# EAGLE design EXTRUDER (EAGLE 6.5.0)
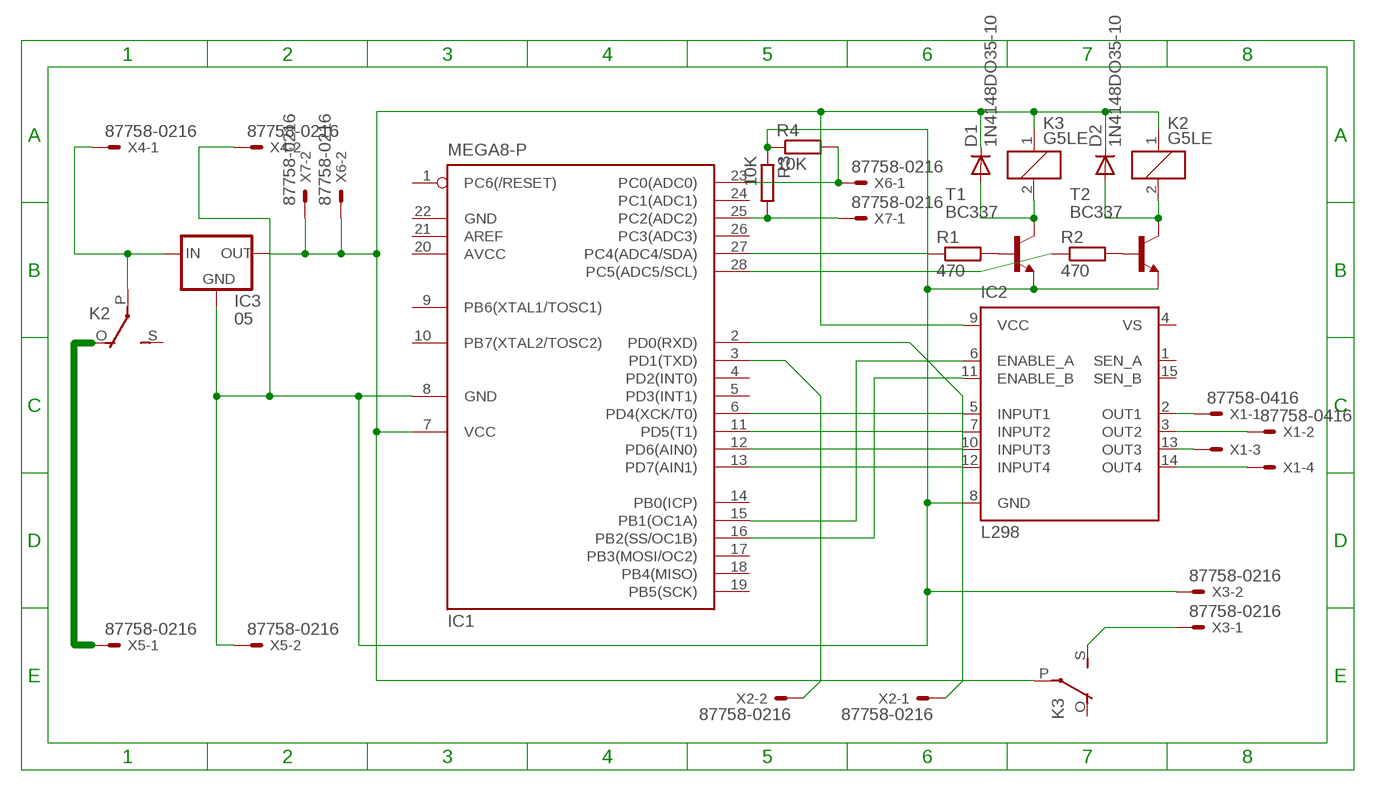
[diagram p0: schematic, sheet 1]

## Parts
D1  1N4148DO35-10  [DO35-10]
D2  1N4148DO35-10  [DO35-10]
IC1  MEGA8-P  [DIL28-3]
IC2  L298  [MULTIWATT-15]
IC3  05  78XXL  [78XXL]
K2  G5LE  [G5LE]
K3  G5LE  [G5LE]
R1  470  R-EU_0204/5  [0204/5]
R2  470  R-EU_0204/5  [0204/5]
R3  10K  R-EU_0204/5  [0204/5]
R4  10K  R-EU_0204/5  [0204/5]
T1  BC337  [TO92]
T2  BC337  [TO92]
X1  87758-0416  [87758-0416]
X2  87758-0216  [87758-0216]
X3  87758-0216  [87758-0216]
X4  87758-0216  [87758-0216]
X5  87758-0216  [87758-0216]
X6  87758-0216  [87758-0216]
X7  87758-0216  [87758-0216]

## Nets
N$1: IC1.6(PD4(XCK/T0)) IC2.5(INPUT1)
N$2: IC1.11(PD5(T1)) IC2.7(INPUT2)
N$3: IC1.12(PD6(AIN0)) IC2.10(INPUT3)
N$4: IC1.13(PD7(AIN1)) IC2.12(INPUT4)
N$5: IC1.15(PB1(OC1A)) IC2.6(ENABLE_A)
N$6: IC1.16(PB2(SS/OC1B)) IC2.11(ENABLE_B)
N$7: D1.A K3.2 T1.3(C)
N$9: IC1.23(PC0(ADC0)) R4.2 X6.1
N$10: D2.A K2.2 T2.3(C)
N$11: D1.C D2.C IC1.7(VCC) IC2.9(VCC) IC3.OUT K2.1 K3.1 K3.P(2:P) X6.2 X7.2
N$13: R1.2 T1.2(B)
N$14: R2.2 T2.2(B)
N$15: IC1.27(PC4(ADC4/SDA)) R1.1
N$16: IC1.28(PC5(ADC5/SCL)) R2.1
N$17: IC1.3(PD1(TXD)) X2.2
N$18: IC1.2(PD0(RXD)) X2.1
N$19: IC2.2(OUT1) X1.1
N$20: IC2.3(OUT2) X1.2
N$21: IC2.13(OUT3) X1.3
N$22: IC2.14(OUT4) X1.4
N$23: K3.S(2:S) X3.1
N$24: IC3.IN K2.P(2:P) X4.1
N$25: IC1.25(PC2(ADC2)) R3.2 X7.1
N$26: K2.O(2:O) X5.1
N$27: IC1.8(GND) IC2.8(GND) IC3.GND R3.1 R4.1 T1.1(E) T2.1(E) X3.2 X4.2 X5.2
Unconnected: IC1.1(PC6(/RESET)) IC1.4(PD2(INT0)) IC1.5(PD3(INT1)) IC1.9(PB6(XTAL1/TOSC1)) IC1.10(PB7(XTAL2/TOSC2)) IC1.14(PB0(ICP)) IC1.17(PB3(MOSI/OC2)) IC1.18(PB4(MISO)) IC1.19(PB5(SCK)) IC1.21(AREF) IC1.24(PC1(ADC1)) IC1.26(PC3(ADC3)) IC2.1(SEN_A) IC2.15(SEN_B) K2.S(2:S) K3.O(2:O)

## Power pins joined to a net without a drawn wire
AVCC: IC1.20(AVCC)
GND: IC1.22(GND)
VS: IC2.4(VS)

## Library data of the parts
D1 D2 = diode:1N4148: DIODE high speed (Philips)
IC1 = atmel:MEGA8-P: MICROCONTROLLER 8 Kbytes FLASH, 1 kbytes SRAM, 512 bytes EEPROM, USART, 4-channel 10 bit ADC, 2-channel 8 bit ADC Pin compatible with Atmega48, ATMega88, ATMega168 Source: avr.lbr; OC_FARNELL: unknown; OC_NEWARK: unknown
IC2 = st-microelectronics:L298: DUAL FULL-BRIDGE DRIVER; MPN: L298N; OC_FARNELL: 1589425; OC_NEWARK: 32M1527
IC3 = v-reg:78XXL: VOLTAGE REGULATOR
K2 K3 = relay:G5LE: RELAY 1 x switch, 10 A/120 V AC, 8 A/30 V DC, Omron; OC_FARNELL: unknown; OC_NEWARK: unknown
R1-R4 = rcl:R-EU_: RESISTOR, European symbol
T1 T2 = transistor:BC337: NPN TRANSISTOR
X1 = con-molex:87758-0416: 4 Pin - 2mm Dual Row Single Wafer, Vertical T/H HDR Source: http://www.molex.com/pdm_docs/sd/877580616_sd.pdf; MF: FARNELL; MPN: 87758-0416; OC_FARNELL: 7472315; OC_NEWARK: 39K3681
X2-X7 = con-molex:87758-0216: 2 Pin - 2mm Dual Row Single Wafer, Vertical T/H HDR Source: http://www.molex.com/pdm_docs/sd/877580616_sd.pdf; MPN: 87758-0216; OC_FARNELL: unknown; OC_NEWARK: 94M1513

## Board
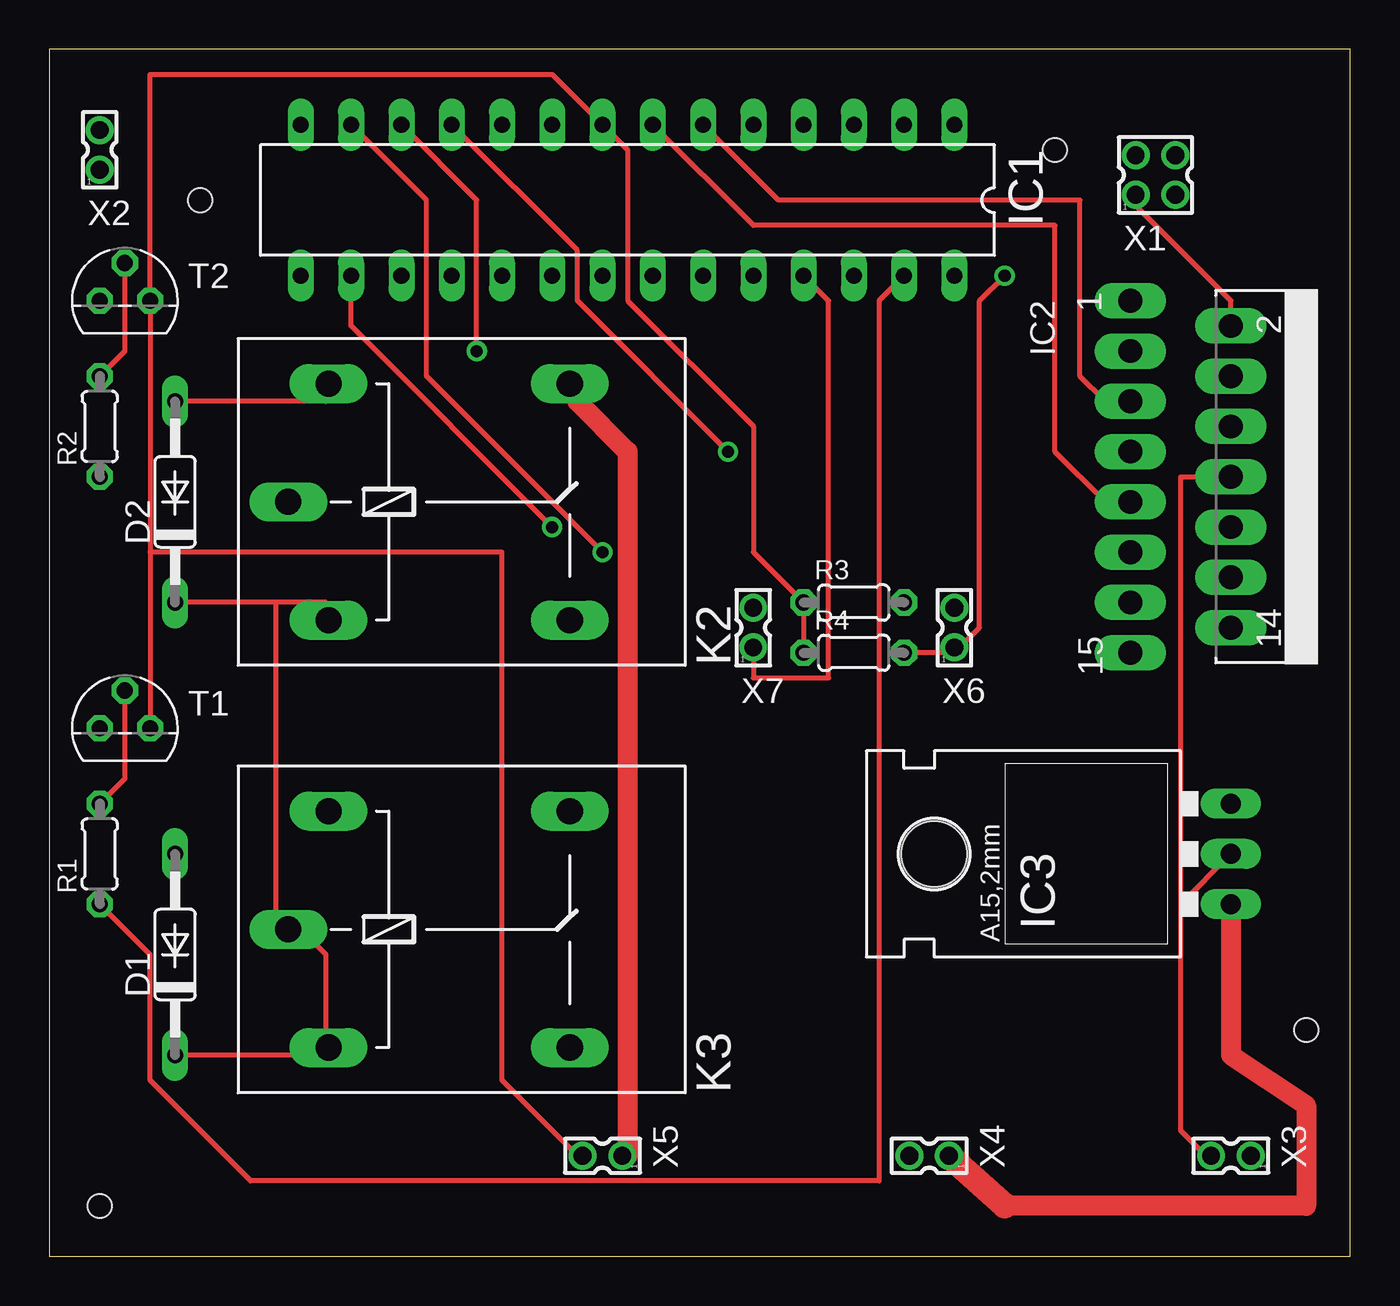
[diagram p1: board, top side]
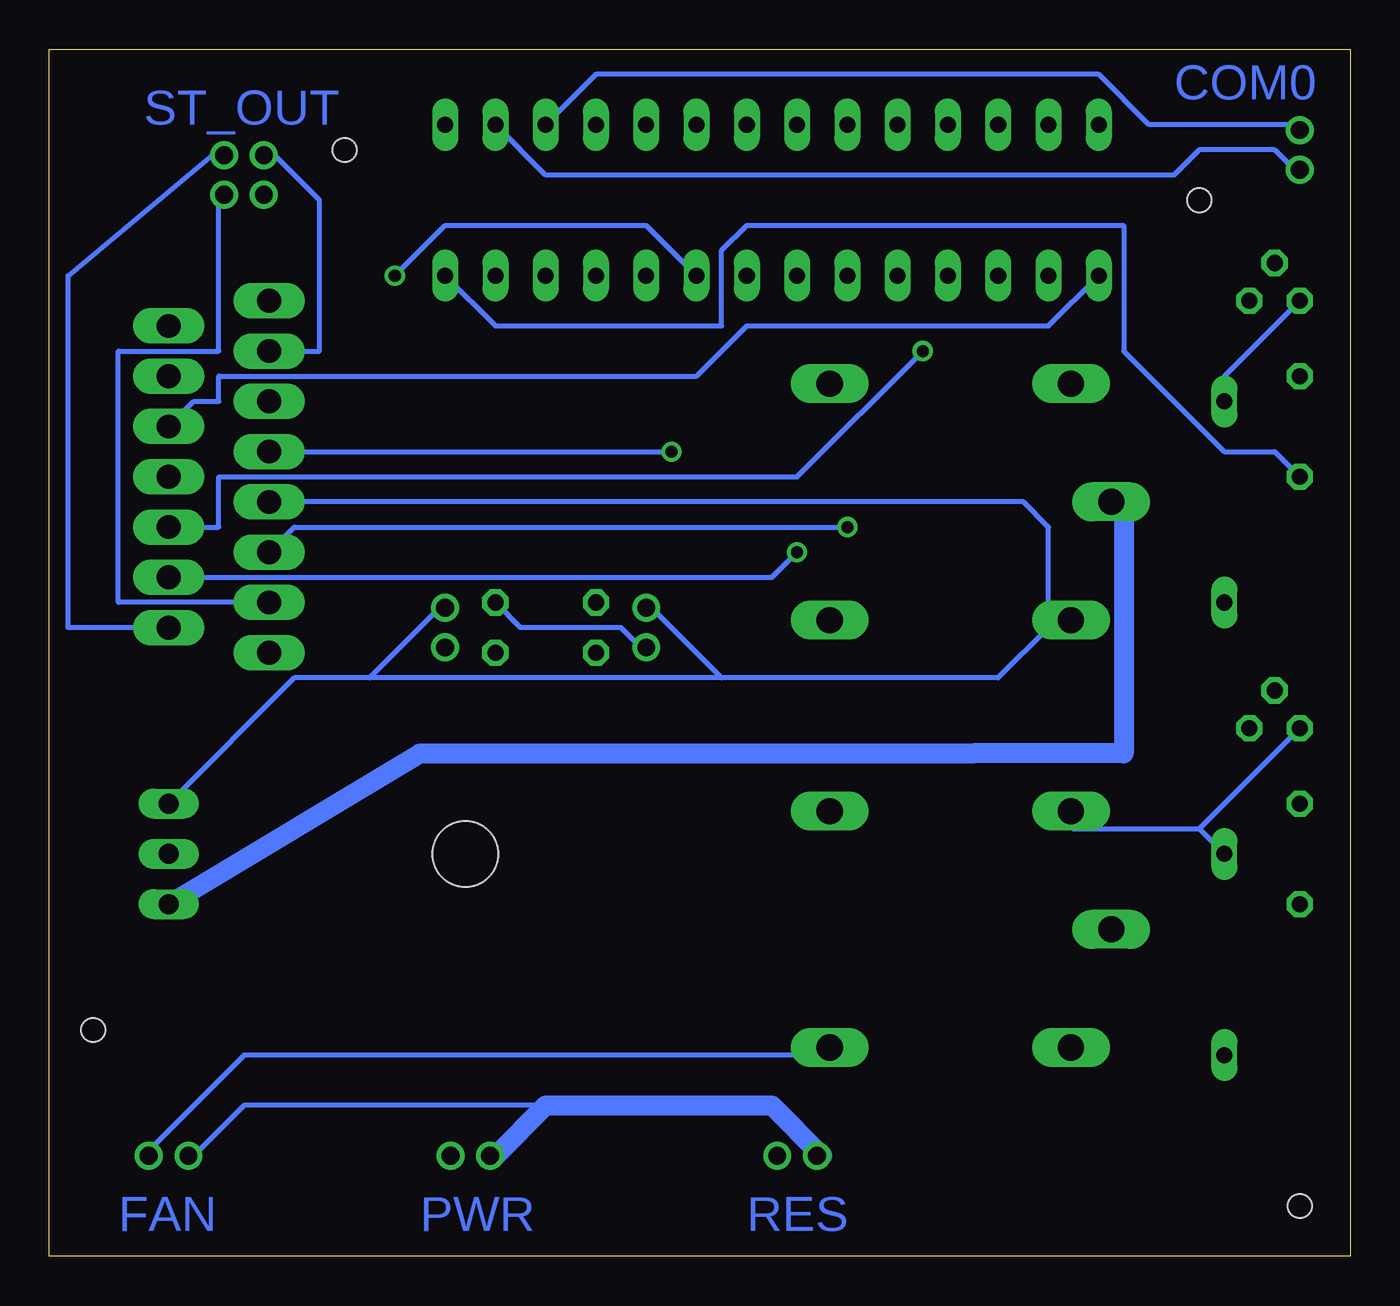
[diagram p2: board, bottom side, seen from below]

Size 65.71 x 60.95 mm. Coordinates in mm from the lower left corner, seen from the top.
Outline: 0,0 65.71,0 65.71,60.95 0,60.95 0,0
Copper layers (1*16): Top 0.035mm / dielectric 1.5mm / Bottom 0.035mm
Design rules "default": minimum track width 10mil, minimum drill 24mil, track to track 8mil, track to pad 8mil, pad to pad 8mil, via to via 8mil, smd to smd 8mil, copper to edge 40mil, drill to drill 8mil, minimum pad ring 10mil, minimum via ring 8mil, stop-mask expansion 4mil, vias tented up to drill 0mil, thermal gap 10mil
Holes 1.2 mm at 50.8,55.88 2.54,2.54 63.5,11.43 7.62,53.34

### Footprints (pad centres in the part's own frame; a part is rotated, then mirrored left to right if it is on the bottom)
DO35-10 = drill 0.813 long: A 5.08,0; C -5.08,0
DIL28-3 = drill 0.813 long: 1 -16.51,-3.81; 2 -13.97,-3.81; 3 -11.43,-3.81; 4 -8.89,-3.81; 5 -6.35,-3.81; 6 -3.81,-3.81; 7 -1.27,-3.81; 8 1.27,-3.81; 9 3.81,-3.81; 10 6.35,-3.81; 11 8.89,-3.81; 12 11.43,-3.81; 13 13.97,-3.81; 14 16.51,-3.81; 15 16.51,3.81; 16 13.97,3.81; 17 11.43,3.81; 18 8.89,3.81; 19 6.35,3.81; 20 3.81,3.81; 21 1.27,3.81; 22 -1.27,3.81; 23 -3.81,3.81; 24 -6.35,3.81; 25 -8.89,3.81; 26 -11.43,3.81; 27 -13.97,3.81; 28 -16.51,3.81
MULTIWATT-15 = drill 1.2 long: 1 -8.89,-7.62; 2 -7.62,-2.54; 3 -6.35,-7.62; 4 -5.08,-2.54; 5 -3.81,-7.62; 6 -2.54,-2.54; 7 -1.27,-7.62; 8 0,-2.54; 9 1.27,-7.62; 10 2.54,-2.54; 11 3.81,-7.62; 12 5.08,-2.54; 13 6.35,-7.62; 14 7.62,-2.54; 15 8.89,-7.62
78XXL = drill 1.016 long: GND 0,-3.81; IN -2.54,-3.81; OUT 2.54,-3.81 | hole 3.302: 0,11.176
G5LE = drill 1.321 long: 1 -7.493,-5.969; 2 -7.493,5.969; O 4.699,5.969; P -9.525,0; S 4.699,-5.969
0204/5 = drill 0.813 octagon: 1 -2.54,0; 2 2.54,0
TO92 = drill 0.813 octagon: 1 1.27,0; 2 0,1.905; 3 -1.27,0
87758-0416 = drill 0.9 pad 1.27: 1 -1,-1; 2 -1,1; 3 1,-1; 4 1,1
87758-0216 = drill 0.9 pad 1.27: 1 0,-1; 2 0,1

### Placement (x,y rotation side)
D1  6.35,15.24 90 top
D2  6.35,38.1 90 top
IC1  29.21,53.34 180 top
IC2  62.23,39.37 270 top
IC3  55.88,20.32 90 top
K2  21.59,38.1 0 top
K3  21.59,16.51 0 top
R1  2.54,20.32 90 top
R2  2.54,41.91 90 top
R3  40.64,33.02 0 top
R4  40.64,30.48 0 top
T1  3.81,26.67 0 top
T2  3.81,48.26 0 top
X1  55.88,54.61 0 top
X2  2.54,55.88 0 top
X3  59.69,5.08 90 top
X4  44.45,5.08 90 top
X5  27.94,5.08 90 top
X6  45.72,31.75 0 top
X7  35.56,31.75 0 top

### Tracks (layer width: path | path; a pad name or v marks a point on that pad's centre or on a via)
N$1
  Top 0.254: IC1.6 36.83,53.34 52.07,53.34 52.07,44.45 53.34,43.18 IC2.5
N$2  (via drill 0.61)
  Top 0.254: IC1.11 26.67,50.8 26.67,48.26 v34.29,40.64
  Bottom 0.254: IC2.7 v34.29,40.64
N$3  (via drill 0.61)
  Top 0.254: IC1.12 21.59,53.34 v21.59,45.72
  Bottom 0.254: v21.59,45.72 27.94,39.37 57.15,39.37 57.15,36.83 IC2.10
N$4  (via drill 0.61)
  Top 0.254: IC1.13 19.05,53.34 19.05,44.45 v27.94,35.56
  Bottom 0.254: v27.94,35.56 29.21,34.29 IC2.12
N$5
  Bottom 0.254: IC1.15 15.24,46.99 30.48,46.99 33.02,44.45 57.15,44.45 57.15,43.18 58.42,43.18 IC2.6
N$6  (via drill 0.61)
  Top 0.254: IC1.16 15.24,46.99 v25.4,36.83
  Bottom 0.254: v25.4,36.83 53.34,36.83 IC2.11
N$7
  Bottom 0.254: 7.62,21.59 D1.A | 7.62,21.59 13.97,21.59 K3.2 | 7.62,21.59 T1.3
N$9  (via drill 0.61)
  Top 0.254: v48.26,49.53 46.99,48.26 46.99,31.75 45.72,30.48 | 45.72,30.48 R4.2 | 45.72,30.48 X6.1
  Bottom 0.254: IC1.23 35.56,52.07 45.72,52.07 v48.26,49.53
N$10
  Top 0.254: D2.A 13.97,43.18 K2.2
  Bottom 0.254: T2.3 6.35,44.45 D2.A
N$11
  Top 0.254: IC1.7 35.56,52.07 50.8,52.07 50.8,40.64 53.34,38.1 IC2.9 | D1.C 13.97,10.16 K3.1 13.97,11.43 13.97,15.24 12.7,16.51 K3.P 11.43,16.51 11.43,33.02 | 11.43,33.02 13.97,33.02 K2.1 | 11.43,33.02 D2.C
  Bottom 0.254: IC3.OUT 53.34,29.21 49.53,29.21 | 31.75,29.21 17.78,29.21 15.24,31.75 K2.1 15.24,33.02 15.24,36.83 16.51,38.1 IC2.9 | 31.75,29.21 49.53,29.21 | 31.75,29.21 35.56,33.02 X7.2 | 49.53,29.21 45.72,33.02 X6.2
N$13
  Top 0.254: R1.2 3.81,24.13 T1.2
N$14
  Top 0.254: R2.2 3.81,45.72 T2.2
N$15
  Top 0.254: R1.1 5.08,15.24 5.08,8.89 10.16,3.81 41.91,3.81 41.91,48.26 IC1.27
N$16
  Bottom 0.254: R2.1 3.81,40.64 6.35,40.64 11.43,45.72 11.43,52.07 30.48,52.07 31.75,50.8 31.75,46.99 43.18,46.99 IC1.28
N$17
  Bottom 0.254: IC1.3 38.1,59.69 12.7,59.69 10.16,57.15 2.54,57.15 X2.2
N$18
  Bottom 0.254: IC1.2 40.64,54.61 8.89,54.61 7.62,55.88 3.81,55.88 2.54,54.61 X2.1
N$19
  Top 0.254: IC2.2 59.69,48.26 54.61,53.34 X1.1
N$20
  Bottom 0.254: IC2.3 52.07,45.72 52.07,53.34 54.61,55.88 X1.2
N$21
  Bottom 0.254: IC2.13 62.23,33.02 62.23,45.72 57.15,45.72 57.15,53.34 X1.3
N$22
  Bottom 0.254: IC2.14 64.77,31.75 64.77,49.53 57.15,55.88 X1.4
N$23
  Bottom 0.254: X3.1 60.96,5.08 55.88,10.16 26.67,10.16 K3.S
N$24
  Top 1.016: 48.26,2.54 63.5,2.54 63.5,7.62 59.69,10.16 IC3.IN
  Top 1.27: 48.26,2.54 X4.1
  Bottom 0.254: 11.43,38.1 K2.P
  Bottom 1.016: 11.43,38.1 11.43,25.4 19.05,25.4 46.99,25.4 IC3.IN
N$25
  Top 0.254: IC1.25 39.37,48.26 39.37,29.21 35.56,29.21 X7.1
  Bottom 0.254: R3.2 41.91,31.75 36.83,31.75 35.56,30.48 X7.1
N$26
  Top 0.254: 29.21,5.08 X5.1 | 26.67,43.18 K2.O
  Top 1.016: 29.21,5.08 29.21,40.64 26.67,43.18
N$27
  Top 0.254: 5.08,35.56 T2.1 5.08,59.69 25.4,59.69 IC1.8 29.21,55.88 29.21,48.26 35.56,41.91 35.56,35.56 R3.1 R4.1 | 5.08,35.56 T1.1 | 57.15,17.78 IC3.GND | 57.15,17.78 57.15,6.35 58.42,5.08 X3.2 | IC2.8 57.15,39.37 57.15,17.78 | 5.08,35.56 22.86,35.56 22.86,8.89 26.67,5.08 X5.2
  Bottom 0.254: 26.67,5.08 X5.2 | 43.18,5.08 X4.2 | 40.64,7.62 55.88,7.62 58.42,5.08 X3.2
  Bottom 1.016: 26.67,5.08 29.21,7.62 40.64,7.62 43.18,5.08

### Text on the board
Bottom: COM0 | ST_OUT | FAN | RES | PWR | FAN